# EAGLE schematic LAB_20200315_0_VoltageDivider (EAGLE 9.3.2)
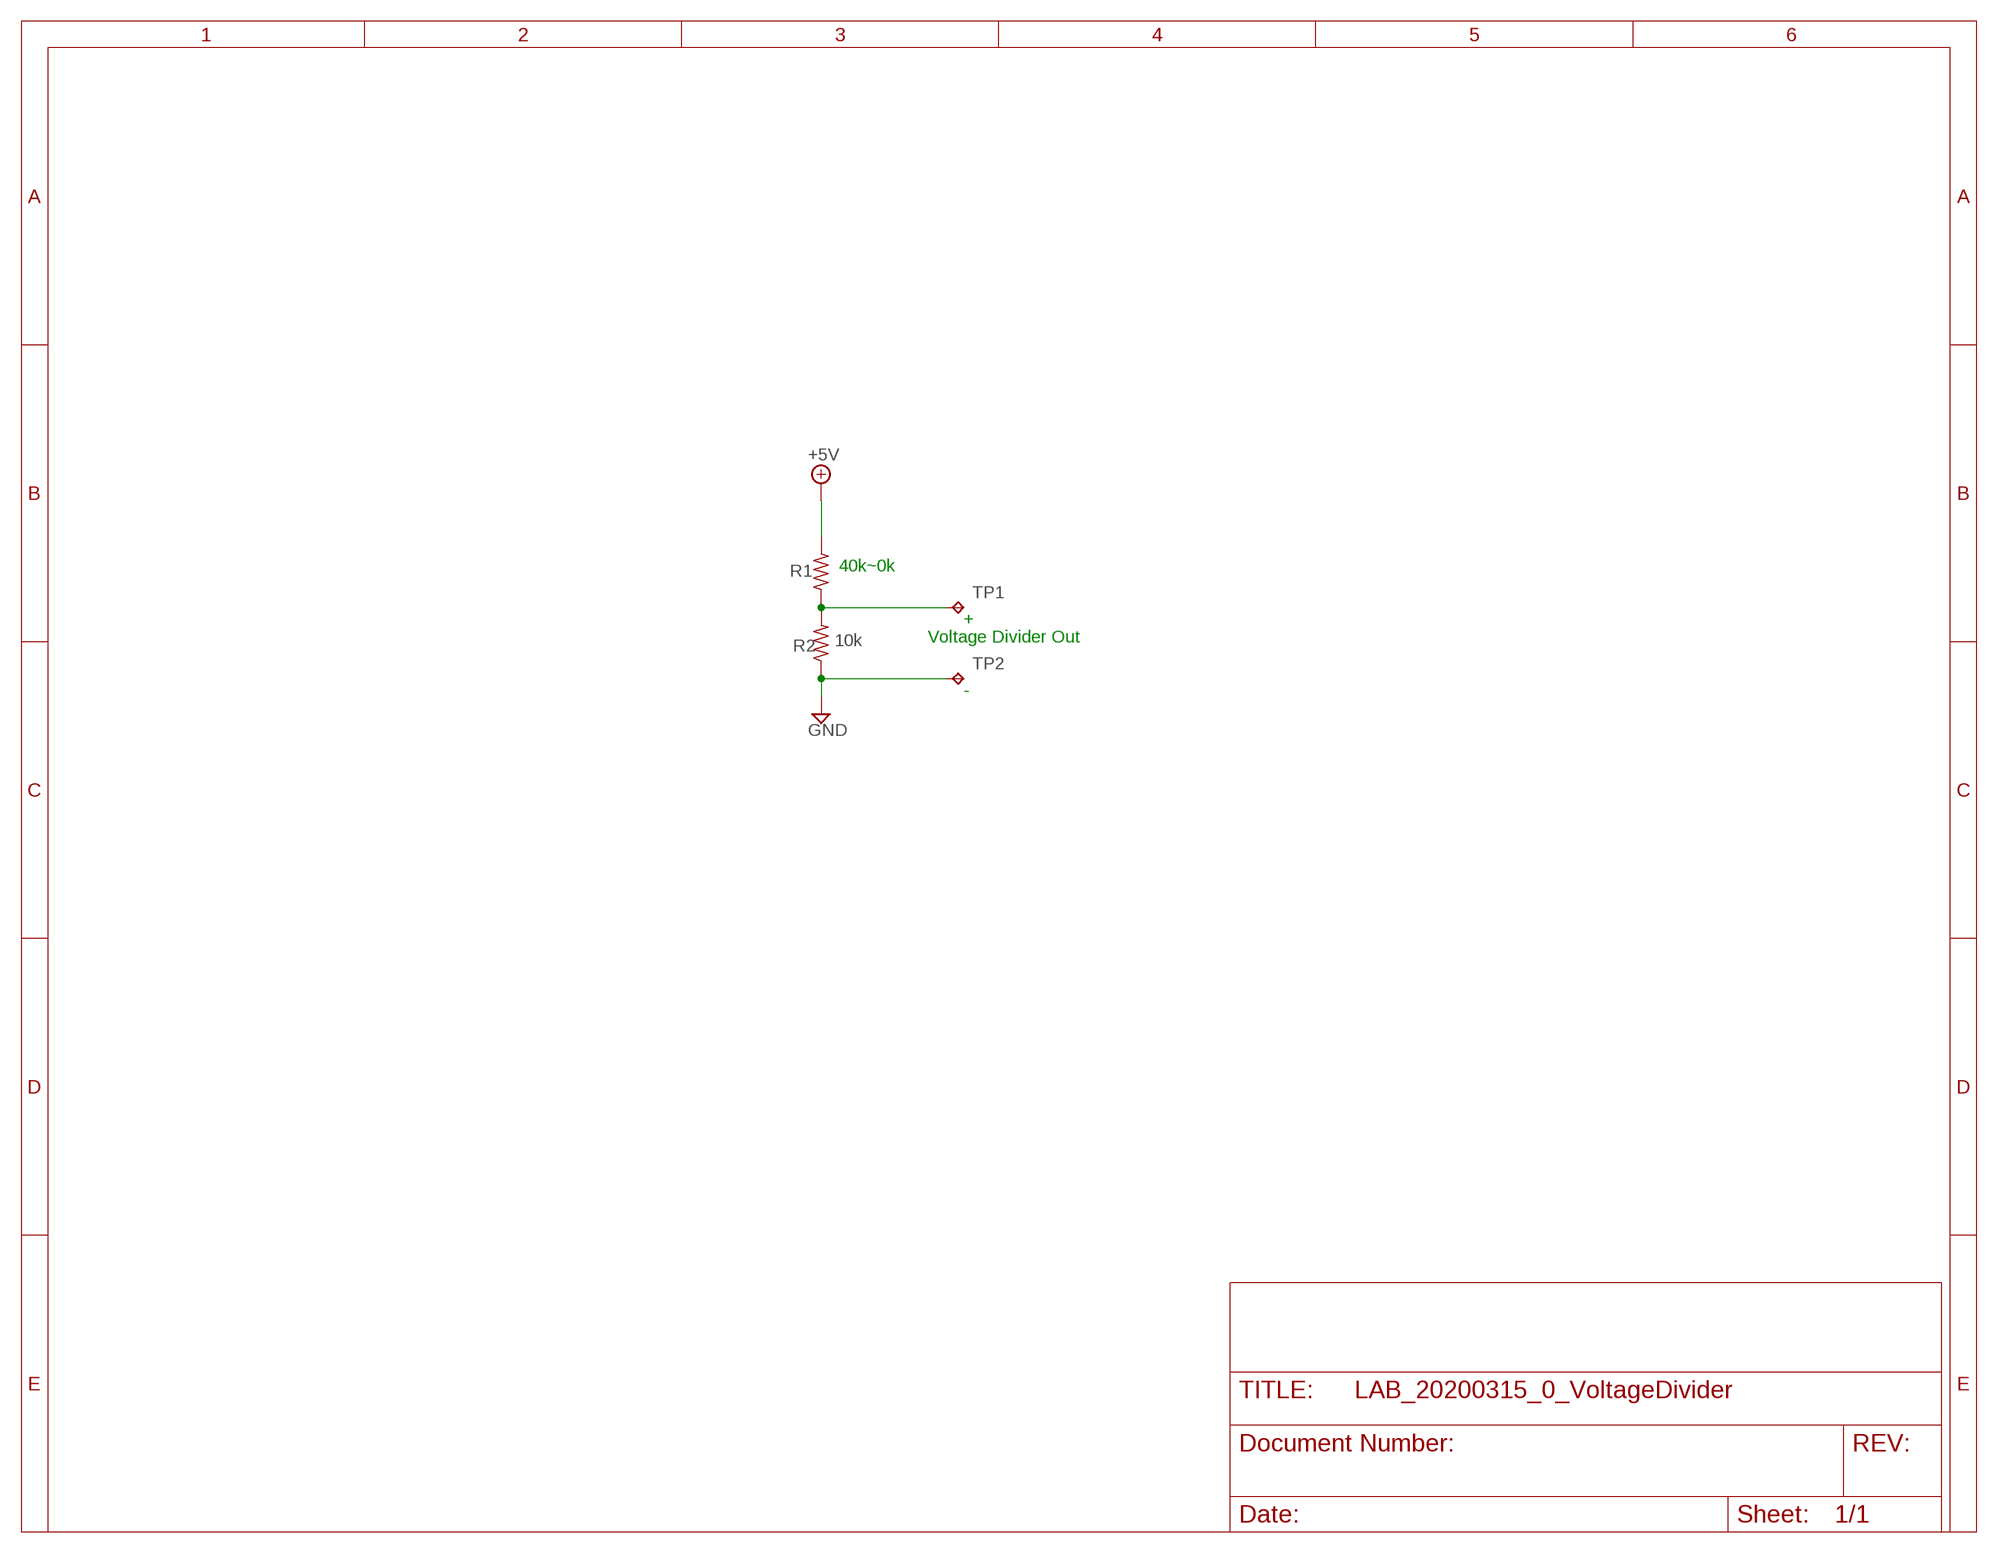
[diagram p0: schematic, sheet 1]

## Parts
R1  R-US_0207/12  [0207/12]
R2  10k  R-US_0207/12  [0207/12]
TP1  TPB1,27  [B1,27]
TP2  TPB1,27  [B1,27]

## Nets
+5V: R1.2
GND: R2.1 TP2.TP
N$1: R1.1 R2.2 TP1.TP

## Notes on the sheet
- 40k~0k
- +
- Voltage Divider Out
- -

## Library data of the parts
R1 R2 = rcl:R-US_: RESISTOR, American symbol; SPICEPREFIX: R
TP1 TP2 = testpad:TP: Test pad